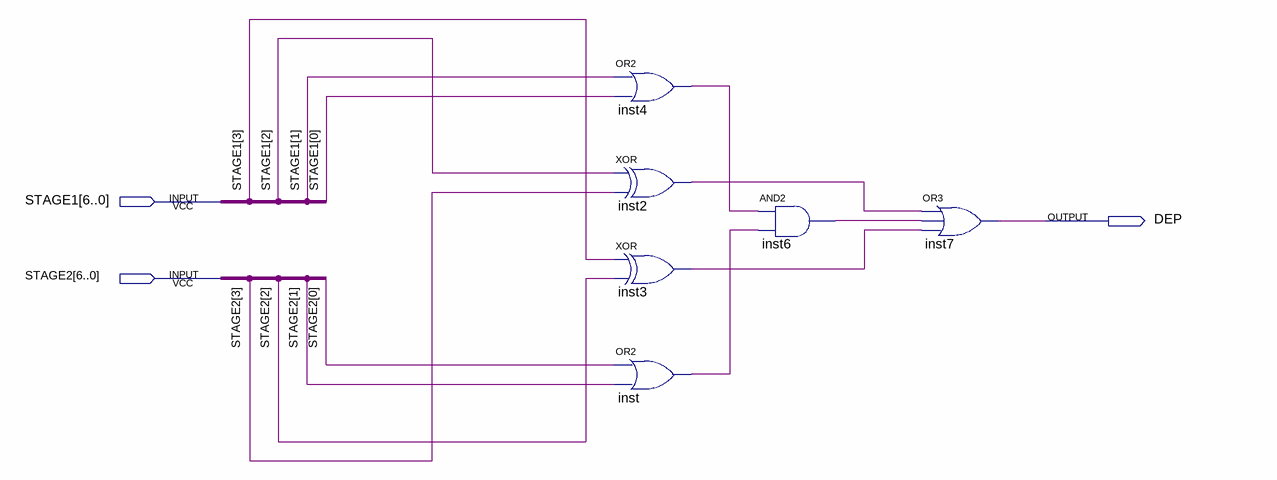
[diagram p0: schematic sheet]
// Quartus schematic dependences.bdf as structural Verilog: 6 symbols, 3 pins
module dependences (
  input  [6:0] STAGE1,
  input  [6:0] STAGE2,
  output DEP
);

  wire inst2_out, inst3_out, inst4_out, inst6_out, inst_out;

  or inst4 (inst4_out, STAGE1[1], STAGE1[0]);
  xor inst2 (inst2_out, STAGE1[2], STAGE2[3]);
  xor inst3 (inst3_out, STAGE1[3], STAGE2[2]);
  or inst (inst_out, STAGE2[0], STAGE2[1]);
  and inst6 (inst6_out, inst4_out, inst_out);
  or inst7 (DEP, inst2_out, inst6_out, inst3_out);
endmodule
